# Altium schematic sheet Power_Supply.SchDoc
size A3; SheetNumber: 4; SheetTotal: 5
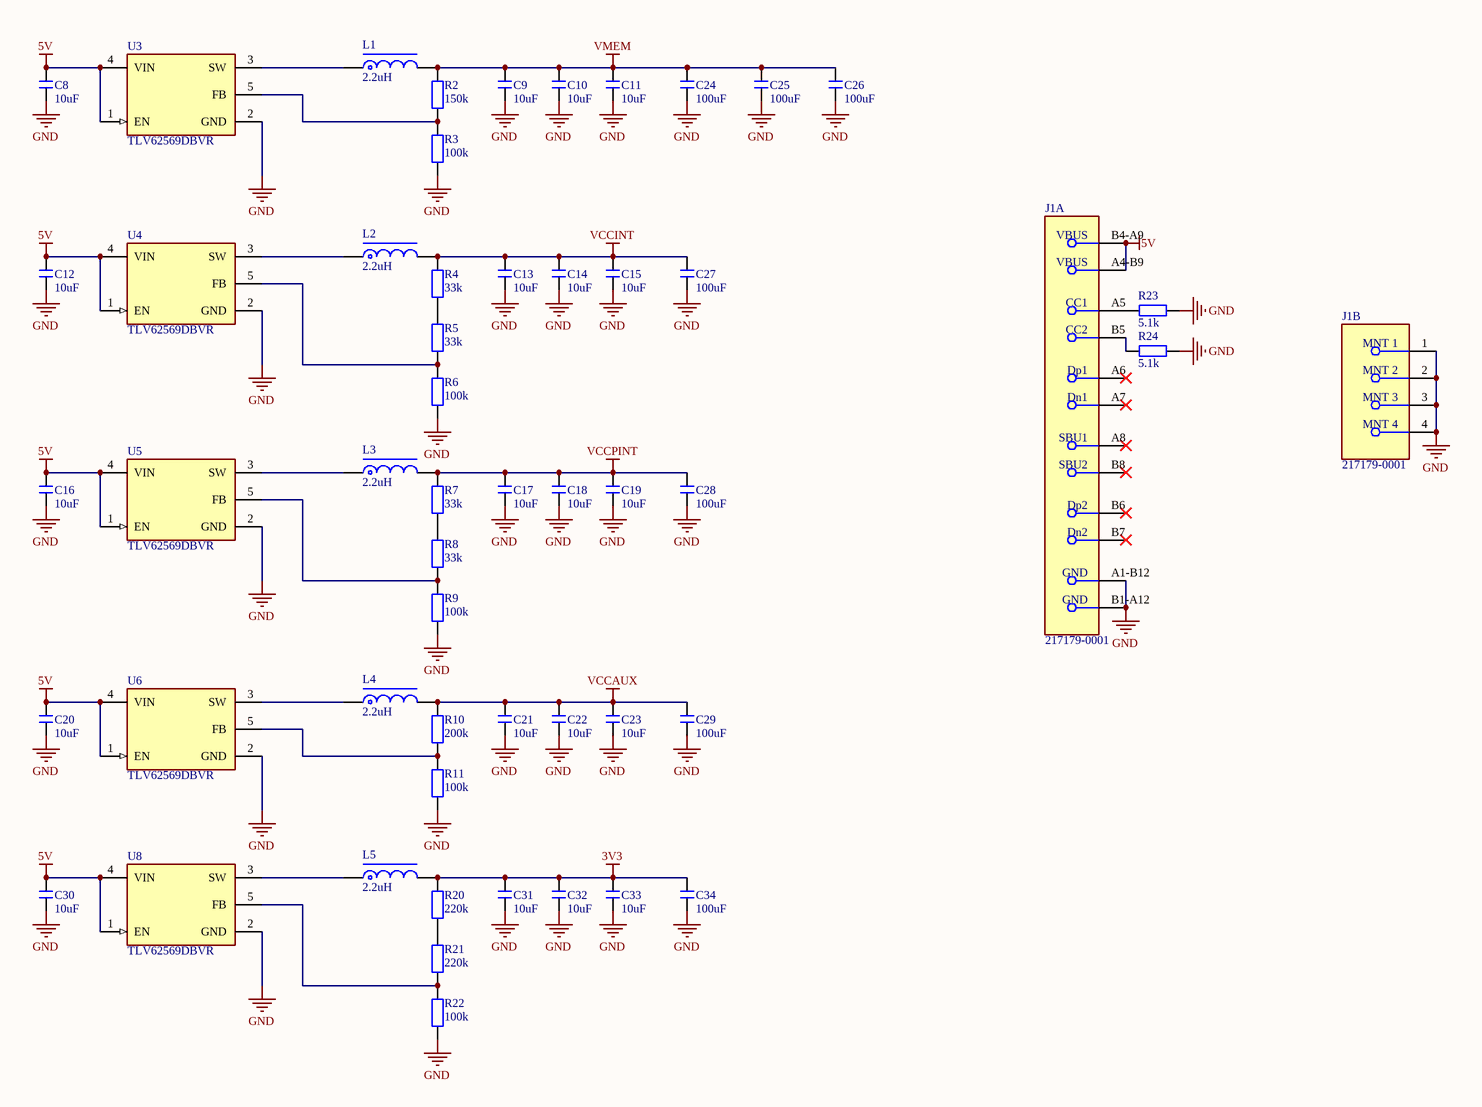
[diagram p0: Power_Supply.SchDoc]

## Parts
C8  10uF  [C0603]
C9  10uF  [C0603]
C10  10uF  [C0603]
C11  10uF  [C0603]
C12  10uF  [C0603]
C13  10uF  [C0603]
C14  10uF  [C0603]
C15  10uF  [C0603]
C16  10uF  [C0603]
C17  10uF  [C0603]
C18  10uF  [C0603]
C19  10uF  [C0603]
C20  10uF  [C0603]
C21  10uF  [C0603]
C22  10uF  [C0603]
C23  10uF  [C0603]
C24  100uF  [C1206]
C25  100uF  [C1206]
C26  100uF  [C1206]
C27  100uF  [C1206]
C28  100uF  [C1206]
C29  100uF  [C1206]
C30  10uF  [C0603]
C31  10uF  [C0603]
C32  10uF  [C0603]
C33  10uF  [C0603]
C34  100uF  [C1206]
J1  217179-0001  [FP-217179-0001-MFG]  (parts A,B of 2)
L1  2.2uH  [CD31]
L2  2.2uH  [CD31]
L3  2.2uH  [CD31]
L4  2.2uH  [CD31]
L5  2.2uH  [CD31]
R2  150k  [R0603]
R3  100k  [R0603]
R4  33k  [R0402]
R5  33k  [R0402]
R6  100k  [R0603]
R7  33k  [R0402]
R8  33k  [R0402]
R9  100k  [R0603]
R10  200k  [R0603]
R11  100k  [R0603]
R20  220k  [R0402]
R21  220k  [R0402]
R22  100k  [R0603]
R23  5.1k  [R0402]
R24  5.1k  [R0402]
U3  TLV62569DBVR  [FP-DBV0005A-MFG]
U4  TLV62569DBVR  [FP-DBV0005A-MFG]
U5  TLV62569DBVR  [FP-DBV0005A-MFG]
U6  TLV62569DBVR  [FP-DBV0005A-MFG]
U8  TLV62569DBVR  [FP-DBV0005A-MFG]

## Nets
3V3: C31.1 C32.1 C33.1 C34.1 L5.2 R20.2
5V: C8.1 C12.1 C16.1 C20.1 C30.1 J1.A4-B9(VBUS) J1.B4-A9(VBUS) U3.1(EN) U3.4(VIN) U4.1(EN) U4.4(VIN) U5.1(EN) U5.4(VIN) U6.1(EN) U6.4(VIN) U8.1(EN) U8.4(VIN)
GND: C8.2 C9.2 C10.2 C11.2 C12.2 C13.2 C14.2 C15.2 C16.2 C17.2 C18.2 C19.2 C20.2 C21.2 C22.2 C23.2 C24.2 C25.2 C26.2 C27.2 C28.2 C29.2 C30.2 C31.2 C32.2 C33.2 C34.2 J1.1(MNT_1) J1.2(MNT_2) J1.3(MNT_3) J1.4(MNT_4) J1.A1-B12(GND) J1.B1-A12(GND) R3.1 R6.1 R9.1 R11.1 R22.1 R23.1 R24.1 U3.2(GND) U4.2(GND) U5.2(GND) U6.2(GND) U8.2(GND)
VCCAUX: C21.1 C22.1 C23.1 C29.1 L4.2 R10.2
VCCINT: C13.1 C14.1 C15.1 C27.1 L2.2 R4.2
VCCPINT: C17.1 C18.1 C19.1 C28.1 L3.2 R7.2
VMEM: C9.1 C10.1 C11.1 C24.1 C25.1 C26.1 L1.2 R2.2
NetJ1_A5: J1.A5(CC1) R23.2
NetJ1_B5: J1.B5(CC2) R24.2
NetL1_1: L1.1 U3.3(SW)
NetL2_1: L2.1 U4.3(SW)
NetL3_1: L3.1 U5.3(SW)
NetL4_1: L4.1 U6.3(SW)
NetL5_1: L5.1 U8.3(SW)
NetR2_1: R2.1 R3.2 U3.5(FB)
NetR4_1: R4.1 R5.2
NetR5_1: R5.1 R6.2 U4.5(FB)
NetR7_1: R7.1 R8.2
NetR8_1: R8.1 R9.2 U5.5(FB)
NetR10_1: R10.1 R11.2 U6.5(FB)
NetR20_1: R20.1 R21.2
NetR21_1: R21.1 R22.2 U8.5(FB)

Not connected (* = marked no-connect by the designer): J1 A6(Dp1)* A7(Dn1)* A8(SBU1)* B6(Dp2)* B7(Dn2)* B8(SBU2)*

## Library data of the parts
C8-C34 = C
J1 = CMP-04767-000028-1: CONN RCP USB2.0 TYP C 24P SMD RA
L1-L5 = L-CD
R2-R11 R20-R24 = R
U3-U6 U8 = CMP-04918-000387-1: IC REG BUCK ADJ 2A SOT23-5; Min Input Voltage: 2.5V; Output Configuration: Positive; Synchronous Rectifier: Yes; Min Output Voltage: 600mV; Output Type: Adjustable; Max Input Voltage: 5.5V; Switching Frequency: 1.5MHz; Packaging: Cut Tape; RoHS Compliant: Yes; Output Current: 2A; Max Output Voltage: 5.5V; Case/Package: SOT-23-5; Min Operating Temperature: -40°C; Max Operating Temperature: 125°C; Mount: Surface Mount